# Altium project 7seg.PrjPcb
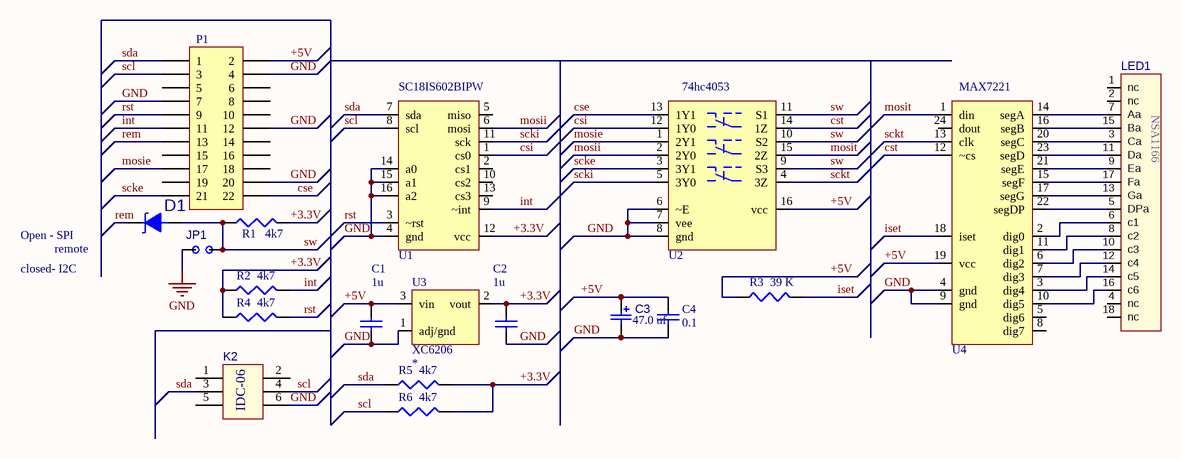
[diagram p0: 7_seg.SchDoc]
1 sheet, 19 parts. Net scope: global (net labels, ports and power ports of the same name join across sheets).
Board file: 7seg.PcbDoc

## Sheet 7_seg.SchDoc
size A4

### Parts
C1  value 1u  [SM0805]  (hidden comment: cap0805)
C2  value 1u  [SM0805]  (hidden comment: cap0805)
C3  CAP_POL_SMB  [CAP_POL_SMB (3528)]  (value not drawn)
C4  value 0.1  [SM0805]  (hidden comment: cap0805)
D1  DiodeShottky_SOD323  [SOD323]  (value not drawn)
JP1  JUMPER2  [JUMPER2]  (value not drawn)
K2  IDC-06  [IDC-06]  (value not drawn)
LED1  NSA1166  [NSA1166]  (value not drawn)
P1  2x11,2.54mm vertical  [PLD-22 ,2x11 ,2.54 mm pitch]  (value not drawn)
R1  value 4k7  [SM0805]  (hidden comment: res0805)
R2  value 4k7  [SM0805]  (hidden comment: res0805)
R3  value 39 K  [SM0805]  (hidden comment: res0805)
R4  value 4k7  [SM0805]  (hidden comment: res0805)
R5  value 4k7  [SM0805]  (hidden comment: res0805)
R6  value 4k7  [SM0805]  (hidden comment: res0805)
U1  SC18IS602BIPW  [SSOP16_body_4.5mm]
U2  74hc4053  [SSOP16_body_4.5mm]
U3  XC6206  [SOT-23]
U4  MAX7221  [WSOIC_24_body_7.5mm]

### Nets
GND: C1.1 C2.1 C3.2(b) C4.2 JP1.2 K2.6 P1.4 P1.7 P1.12 P1.20 U1.4(gnd) U1.14(a0) U1.15(a1) U1.16(a2) U2.6(~E) U2.7(vee) U2.8(gnd) U3.1(adj/gnd) U4.4(gnd) U4.9(gnd)
+3.3V: C2.2 R1.2 R2.1 R4.1 R5.2 R6.2 U1.12(vcc) U3.2(vout)
+5V: C1.2 C3.1(a) C4.1 P1.2 R3.1 U2.16(vcc) U3.3(vin) U4.19(vcc)
cse: P1.22 U2.13(1Y1)
csi: U1.1(cs0) U2.12(1Y0)
cst: U2.14(1Z) U4.12(~cs)
int: P1.11 R2.2 U1.9(~int)
iset: R3.2 U4.18(iset)
mosie: P1.17 U2.1(2Y1)
mosii: U1.6(mosi) U2.2(2Y0)
mosit: U2.15(2Z) U4.1(din)
rem: D1.2(k) P1.13
rst: P1.9 R4.2 U1.3(~rst)
scke: P1.21 U2.3(3Y1)
scki: U1.11(sck) U2.5(3Y0)
sckt: U2.4(3Z) U4.13(clk)
scl: K2.4 P1.3 R6.1 U1.8(scl)
sda: K2.3 P1.1 R5.1 U1.7(sda)
sw: D1.1(a) JP1.1 R1.1 U2.9(S3) U2.10(S2) U2.11(S1)
NetLED1_3: LED1.3(Ca) U4.20(segC)
NetLED1_5: LED1.5(DPa) U4.22(segDP)
NetLED1_6: LED1.6(c1) U4.2(dig0)
NetLED1_7: LED1.7(Aa) U4.14(segA)
NetLED1_8: LED1.8(c2) U4.11(dig1)
NetLED1_9: LED1.9(Ea) U4.21(segE)
NetLED1_10: LED1.10(c3) U4.6(dig2)
NetLED1_11: LED1.11(Da) U4.23(segD)
NetLED1_12: LED1.12(c4) U4.7(dig3)
NetLED1_13: LED1.13(Ga) U4.17(segG)
NetLED1_14: LED1.14(c5) U4.3(dig4)
NetLED1_15: LED1.15(Ba) U4.16(segB)
NetLED1_16: LED1.16(c6) U4.10(dig5)
NetLED1_17: LED1.17(Fa) U4.15(segF)

Not connected (* = marked no-connect by the designer): K2 1 2 5; LED1 1(nc) 2(nc) 4(nc) 18(nc); P1 5 6 8 10 14 15 16 18 19; U1 2(cs1) 5(miso) 10(cs2) 13(cs3); U4 5(dig6) 8(dig7) 24(dout)

### Notes on the sheet
- Open - SPI
- closed- I2C
- remote
- (in symbol CAP_POL_SMB) 47.0 uf

### Library data of the parts
C1 C2 C4 = cap0805: Capacitor; Published: 8-Jun-2000; LatestRevisionDate: 17-Jul-2002; LatestRevisionNote: Re-released for DXP Platform.; PackageReference: RAD-0.3; Publisher: Altium Limited; PackageDescription: Radial Cap, Thru-Hole; 2 Leads; 0.3 in Pin Spacing
C3 = CAP_POL_SMB: CAP_POL_SMB(3528)
D1 = DiodeShottky_SOD323: SOD323
LED1 = NSA1166: NSA retro 7 seg display; Value: *
P1 = 2x11, 2.54mm, vertical: Header, 22-Pin; LatestRevisionDate: 17-Jul-2002; LatestRevisionNote: Re-released for DXP Platform.; Publisher: Altium Limited
R1-R6 = res0805: Resistor; Published: 8-Jun-2000; LatestRevisionDate: 29-May-2009; LatestRevisionNote: IPC-7351 Footprint Added.; PackageReference: J1-0603; Publisher: Altium Limited; PackageDescription: Chip Resistor
U1 = SC18IS602BIPW: i2c to SPI bridge
U2 = 74hc4053: 3 independent SPDT CMOS switch
U3 = XC6206: SOT-23-3 ldo
U4 = MAX7221_WSOIC24: 7 seg 8 digits driver
JP1 = JUMPER2: Value: *